# EAGLE design raspberrypi_debugger (EAGLE 7.3.0)
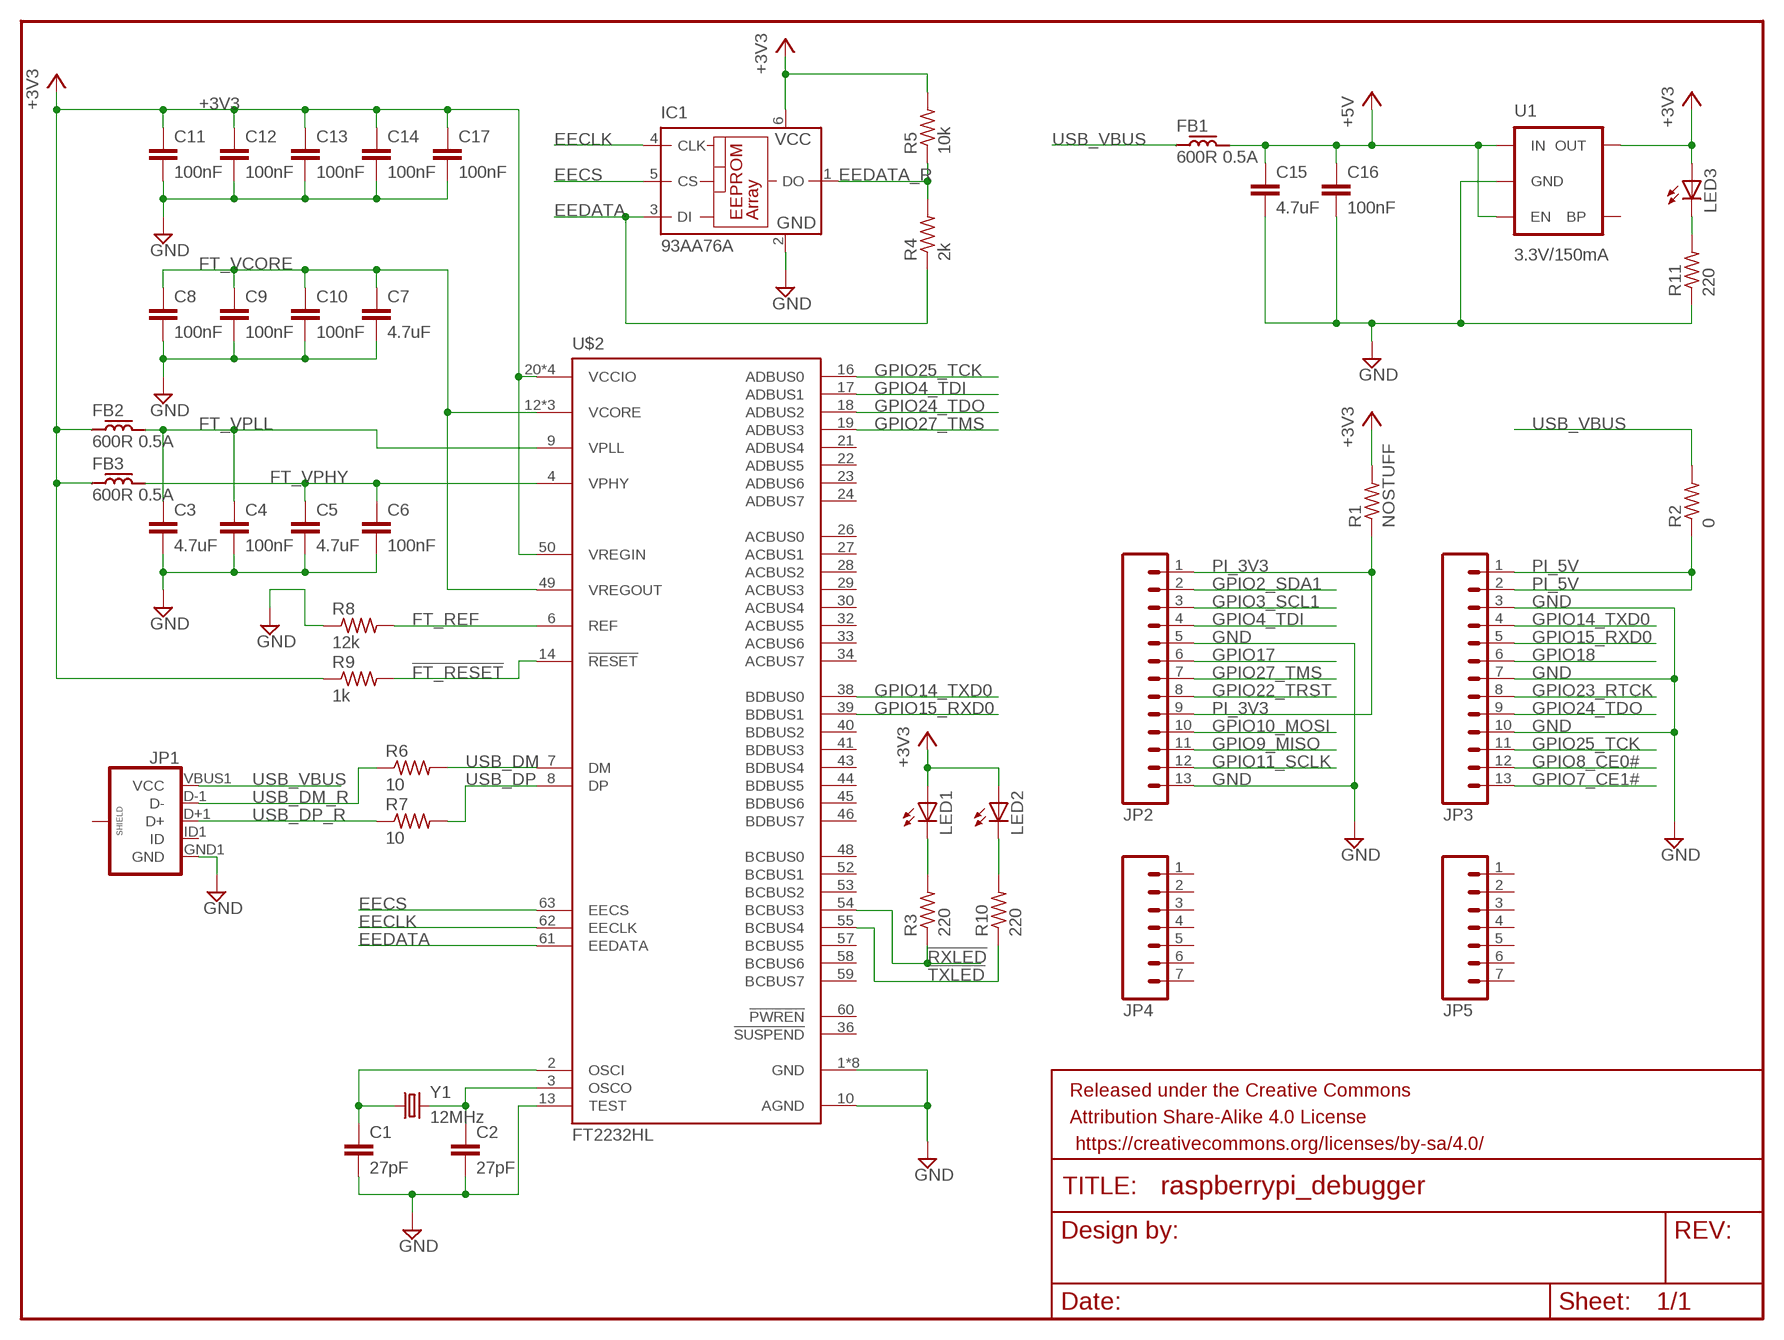
[diagram p0: schematic, sheet 1]

## Parts
C1  27pF  C-EUC0805  [C0805]
C2  27pF  C-EUC0805  [C0805]
C3  4.7uF  C-EUC1206  [C1206]
C4  100nF  C-EUC0805  [C0805]
C5  4.7uF  C-EUC1206  [C1206]
C6  100nF  C-EUC0805  [C0805]
C7  4.7uF  C-EUC1206  [C1206]
C8  100nF  C-EUC0805  [C0805]
C9  100nF  C-EUC0805  [C0805]
C10  100nF  C-EUC0805  [C0805]
C11  100nF  C-EUC0805  [C0805]
C12  100nF  C-EUC0805  [C0805]
C13  100nF  C-EUC0805  [C0805]
C14  100nF  C-EUC0805  [C0805]
C15  4.7uF  C-EUC1206  [C1206]
C16  100nF  C-EUC0805  [C0805]
C17  100nF  C-EUC0805  [C0805]
FB1  600R 0.5A  FERRITE  [R0805]
FB2  600R 0.5A  FERRITE  [R0805]
FB3  600R 0.5A  FERRITE  [R0805]
FRAME1  FRAME-LETTERNO_PACKAGE  [DUMMY]
IC1  93AA76A  [SOT23-6]
JP1  USB_MICROB_PLUGCONN-11752  [USB-B-MICRO-SMD_V03]
JP2  M13LOCK  [1X13_LOCK]
JP3  M13LOCK  [1X13_LOCK]
JP4  M07LOCK  [1X07_LOCK]
JP5  M07LOCK  [1X07_LOCK]
LED1  LEDCHIP-LED0805  [CHIP-LED0805]
LED2  LEDCHIP-LED0805  [CHIP-LED0805]
LED3  LEDCHIP-LED0805  [CHIP-LED0805]
R1  NOSTUFF  R-US_R0805  [R0805]
R2  0  R-US_R0805  [R0805]
R3  220  R-US_R0805  [R0805]
R4  2k  R-US_R0805  [R0805]
R5  10k  R-US_R0805  [R0805]
R6  10  R-US_R0805  [R0805]
R7  10  R-US_R0805  [R0805]
R8  12k  R-US_R0805  [R0805]
R9  1k  R-US_R0805  [R0805]
R10  220  R-US_R0805  [R0805]
R11  220  R-US_R0805  [R0805]
U1  3.3V/150mA  V_REG_MIC52053.3V  [SOT23-5]
U$2  FT2232HL  [TQFP64-10X10]
Y1  12MHz  CRYSTALSMD  [HC49UP]

## Nets
!FT_RESET: R9.2 U$2.14(!RESET)
!RXLED: R3.1 U$2.54(BCBUS3)
!TXLED: R10.1 U$2.55(BCBUS4)
+3V3: C11.1 C12.1 C13.1 C14.1 C17.1 FB2.2 FB3.2 IC1.6(VCC) LED1.A LED2.A LED3.A R1.2 R5.2 R9.1 U1.5(OUT) U$2.20(VCCIO) U$2.31(VCCIO) U$2.42(VCCIO) U$2.50(VREGIN) U$2.56(VCCIO)
+5V: C15.1 C16.1 FB1.1 U1.1(IN) U1.3(EN)
EECLK: IC1.4(CLK) U$2.62(EECLK)
EECS: IC1.5(CS) U$2.63(EECS)
EEDATA: IC1.3(DI) R4.1 U$2.61(EEDATA)
EEDATA_R: IC1.1(DO) R4.2 R5.1
FT_REF: R8.2 U$2.6(REF)
FT_VCORE: C7.1 C8.1 C9.1 C10.1 U$2.12(VCORE) U$2.37(VCORE) U$2.49(VREGOUT) U$2.64(VCORE)
FT_VPHY: C5.1 C6.1 FB3.1 U$2.4(VPHY)
FT_VPLL: C3.1 C4.1 FB2.1 U$2.9(VPLL)
GND: C1.2 C2.2 C3.2 C4.2 C5.2 C6.2 C7.2 C8.2 C9.2 C10.2 C11.2 C12.2 C13.2 C14.2 C15.2 C16.2 C17.2 IC1.2(GND) JP1.GND1(GND) JP2.5 JP2.13 JP3.3 JP3.7 JP3.10 R8.1 R11.1 U1.2(GND) U$2.1(GND) U$2.5(GND) U$2.10(AGND) U$2.11(GND) U$2.13(TEST) U$2.15(GND) U$2.25(GND) U$2.35(GND) U$2.47(GND) U$2.51(GND)
GPIO2_SDA1: JP2.2
GPIO3_SCL1: JP2.3
GPIO4_TDI: JP2.4 U$2.17(ADBUS1)
GPIO7_CE1#: JP3.13
GPIO8_CE0#: JP3.12
GPIO9_MISO: JP2.11
GPIO10_MOSI: JP2.10
GPIO11_SCLK: JP2.12
GPIO14_TXD0: JP3.4 U$2.38(BDBUS0)
GPIO15_RXD0: JP3.5 U$2.39(BDBUS1)
GPIO17: JP2.6
GPIO18: JP3.6
GPIO22_TRST: JP2.8
GPIO23_RTCK: JP3.8
GPIO24_TDO: JP3.9 U$2.18(ADBUS2)
GPIO25_TCK: JP3.11 U$2.16(ADBUS0)
GPIO27_TMS: JP2.7 U$2.19(ADBUS3)
N$1: C1.1 U$2.2(OSCI) Y1.1
N$2: C2.1 U$2.3(OSCO) Y1.2
N$3: LED1.C R3.2
N$4: LED2.C R10.2
N$5: LED3.C R11.2
PI_3V3: JP2.1 JP2.9 R1.1
PI_5V: JP3.1 JP3.2 R2.1
USB_DM: R6.2 U$2.7(DM)
USB_DM_R: JP1.D-1(D-) R6.1
USB_DP: R7.2 U$2.8(DP)
USB_DP_R: JP1.D+1(D+) R7.1
USB_VBUS: FB1.2 JP1.VBUS1(VCC) R2.2
Unconnected: JP1.ID1(ID) JP1.SHIELD1(SHIELD) JP1.SHIELD2(SHIELD) JP1.SHIELD3(SHIELD) JP4.1 JP4.2 JP4.3 JP4.4 JP4.5 JP4.6 JP4.7 JP5.1 JP5.2 JP5.3 JP5.4 JP5.5 JP5.6 JP5.7 U1.4(BP) U$2.21(ADBUS4) U$2.22(ADBUS5) U$2.23(ADBUS6) U$2.24(ADBUS7) U$2.26(ACBUS0) U$2.27(ACBUS1) U$2.28(ACBUS2) U$2.29(ACBUS3) U$2.30(ACBUS4) U$2.32(ACBUS5) U$2.33(ACBUS6) U$2.34(ACBUS7) U$2.36(!SUSPEND) U$2.40(BDBUS2) U$2.41(BDBUS3) U$2.43(BDBUS4) U$2.44(BDBUS5) U$2.45(BDBUS6) U$2.46(BDBUS7) U$2.48(BCBUS0) U$2.52(BCBUS1) U$2.53(BCBUS2) U$2.57(BCBUS5) U$2.58(BCBUS6) U$2.59(BCBUS7) U$2.60(!PWREN)

## Library data of the parts
C1-C17 = resistor:C-EU: CAPACITOR, European symbol
FB1-FB3 = raspberrypi_debugger_special:FERRITE: INDUCTOR, American symbol
FRAME1 = SparkFun-Aesthetics:FRAME-LETTER: Schematic Frame Standard 8.5x11 US Letter frame; DESIGNER: Nobody; VERSION: v01
IC1 = microchip:93*76?: 8K Microwire Compatible Serial EEPROM Source: http://ww1.microchip.com/downloads/en/DeviceDoc/21796H.pdf; MPN: 93AA76AT-I/OT; OC_FARNELL: 1331443; OC_NEWARK: 35M2481
JP1 = raspberrypi_debugger_special:USB_MICROB_PLUG: USB Micro-B connectors Some male, some female. Watch your step!; PROD_ID: CONN-11752
JP2 JP3 = SparkFun-Connectors:M13: 13-pin single row .1" header
JP4 JP5 = SparkFun-Connectors:M07: Header 7 Standard 7-pin 0.1" header. Use with straight break away headers (SKU : PRT-00116), right angle break away headers (PRT-00553), swiss pins (PRT-00743), machine pins (PRT-00117), and female headers (PRT-00115). NOTES ON THE VARIANTS LOCK and LOCK_LONGPADS... This footprint was designed to help hold the alignment of a through-hole component (i.e. 7-pin header) while soldering it into place. You may notice that each hole has been shifted either up or down by 0.005 of an inch from it's more standard position (which is usually a perfectly straight line). This slight alteration caused the pins (the squares in the middle) to touch the edges of the holes. Because they are alternating, it causes a "brace" to hold the header in place. 0.005 has proven to be the perfect amount of "off-center" position when using our standard breakaway headers. Although looks a little odd when you look at the bare footprint, once you have a header in there, the alteration is very hard to notice. Also, if you push a header all the way into place, it is covered up entirely on the bottom side. This idea of altering the position of holes to aid alignment will be further integrated into the Sparkfun Library for other footprints. It can help hold any component with 3 or more connection pins.
LED1-LED3 = led:LED: LED OSRAM: - CHIPLED LG R971, LG N971, LY N971, LG Q971, LY Q971, LO R971, LY R971 LH N974, LH R974 LS Q976, LO Q976, LY Q976 LO Q996 - Hyper CHIPLED LW Q18S LB Q993, LB Q99A, LB R99A - SideLED LS A670, LO A670, LY A670, LG A670, LP A670 LB A673, LV A673, LT A673, LW A673 LH A674 LY A675 LS A676, LA A676, LO A676, LY A676, LW A676 LS A679, LY A679, LG A679 - Hyper Micro SIDELED® LS Y876, LA Y876, LO Y876, LY Y876 LT Y87S - SmartLED LW L88C, LW L88S LB L89C, LB L89S, LG L890 LS L89K, LO L89K, LY L89K LS L896, LA L896, LO L896, LY L896 - TOPLED LS T670, LO T670, LY T670, LG T670, LP T670 LSG T670, LSP T670, LSY T670, LOP T670, LYG T670 LG T671, LOG T671, LSG T671 LB T673, LV T673, LT T673, LW T673 LH T674 LS T676, LA T676, LO T676, LY T676, LB T676, LH T676, LSB T676, LW T676 LB T67C, LV T67C, LT T67C, LS T67K, LO T67K, LY T67K, LW E67C LS E67B, LA E67B, LO E67B, LY E67B, LB E67C, LV E67C, LT E67C LW T67C LS T679, LY T679, LG T679 LS T770, LO T770, LY T770, LG T770, LP T770 LB T773, LV T773, LT T773, LW T773 LH T774 LS E675, LA E675, LY E675, LS T675 LS T776, LA T776, LO T776, LY T776, LB T776 LHGB T686 LT T68C, LB T68C - Hyper Mini TOPLED® LB M676 - Mini TOPLED Santana® LG M470 LS M47K, LO M47K, LY M47K Source: http://www.osram.convergy.de LUXEON: - LUMILED® LXK2-PW12-R00, LXK2-PW12-S00, LXK2-PW14-U00, LXK2-PW14-V00 LXK2-PM12-R00, LXK2-PM12-S00, LXK2-PM14-U00 LXK2-PE12-Q00, LXK2-PE12-R00, LXK2-PE12-S00, LXK2-PE14-T00, LXK2-PE14-U00 LXK2-PB12-K00, LXK2-PB12-L00, LXK2-PB12-M00, LXK2-PB14-N00, LXK2-PB14-P00, LXK2-PB14-Q00 LXK2-PR12-L00, LXK2-PR12-M00, LXK2-PR14-Q00, LXK2-PR14-R00 LXK2-PD12-Q00, LXK2-PD12-R00, LXK2-PD12-S00 LXK2-PH12-R00, LXK2-PH12-S00 LXK2-PL12-P00, LXK2-PL12-Q00, LXK2-PL12-R00 Source: www.luxeon.com KINGBRIGHT: KA-3528ASYC Source: www.kingbright.com
R1-R11 = resistor:R-US_: RESISTOR, American symbol
U1 = SparkFun-PowerIC:V_REG_MIC5205: V_REG MIC5205 Standard 3.3V, 5V, and Adjustable 150mA LDO voltage regulator in SOT-23 layout. Micrel part MIC5205. BP (by-pass) pin is used to lower output noise with 470pF cap, may be left open. On the adjustable version BP is used to set output.; PROD_ID: VREG-00822
U$2 = raspberrypi_debugger_special:FT2232HL
Y1 = SparkFun-FreqCtrl:CRYSTAL: Various standard crystals. Proven footprints.

## Board
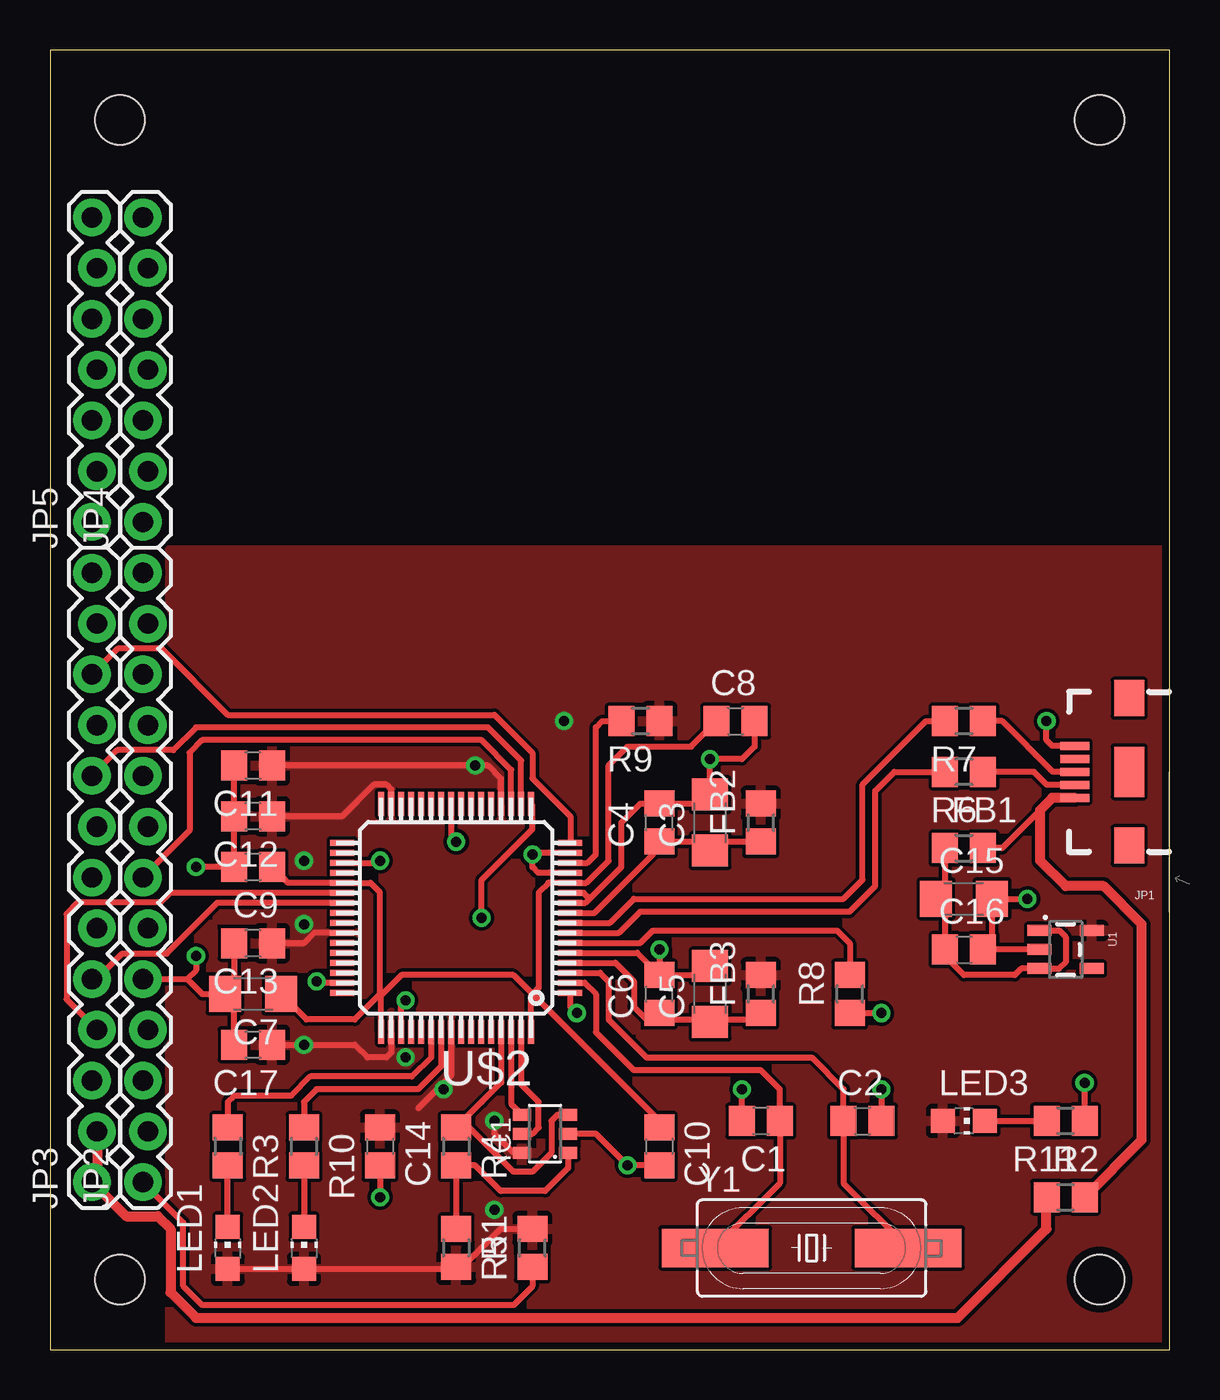
[diagram p1: board, top side]
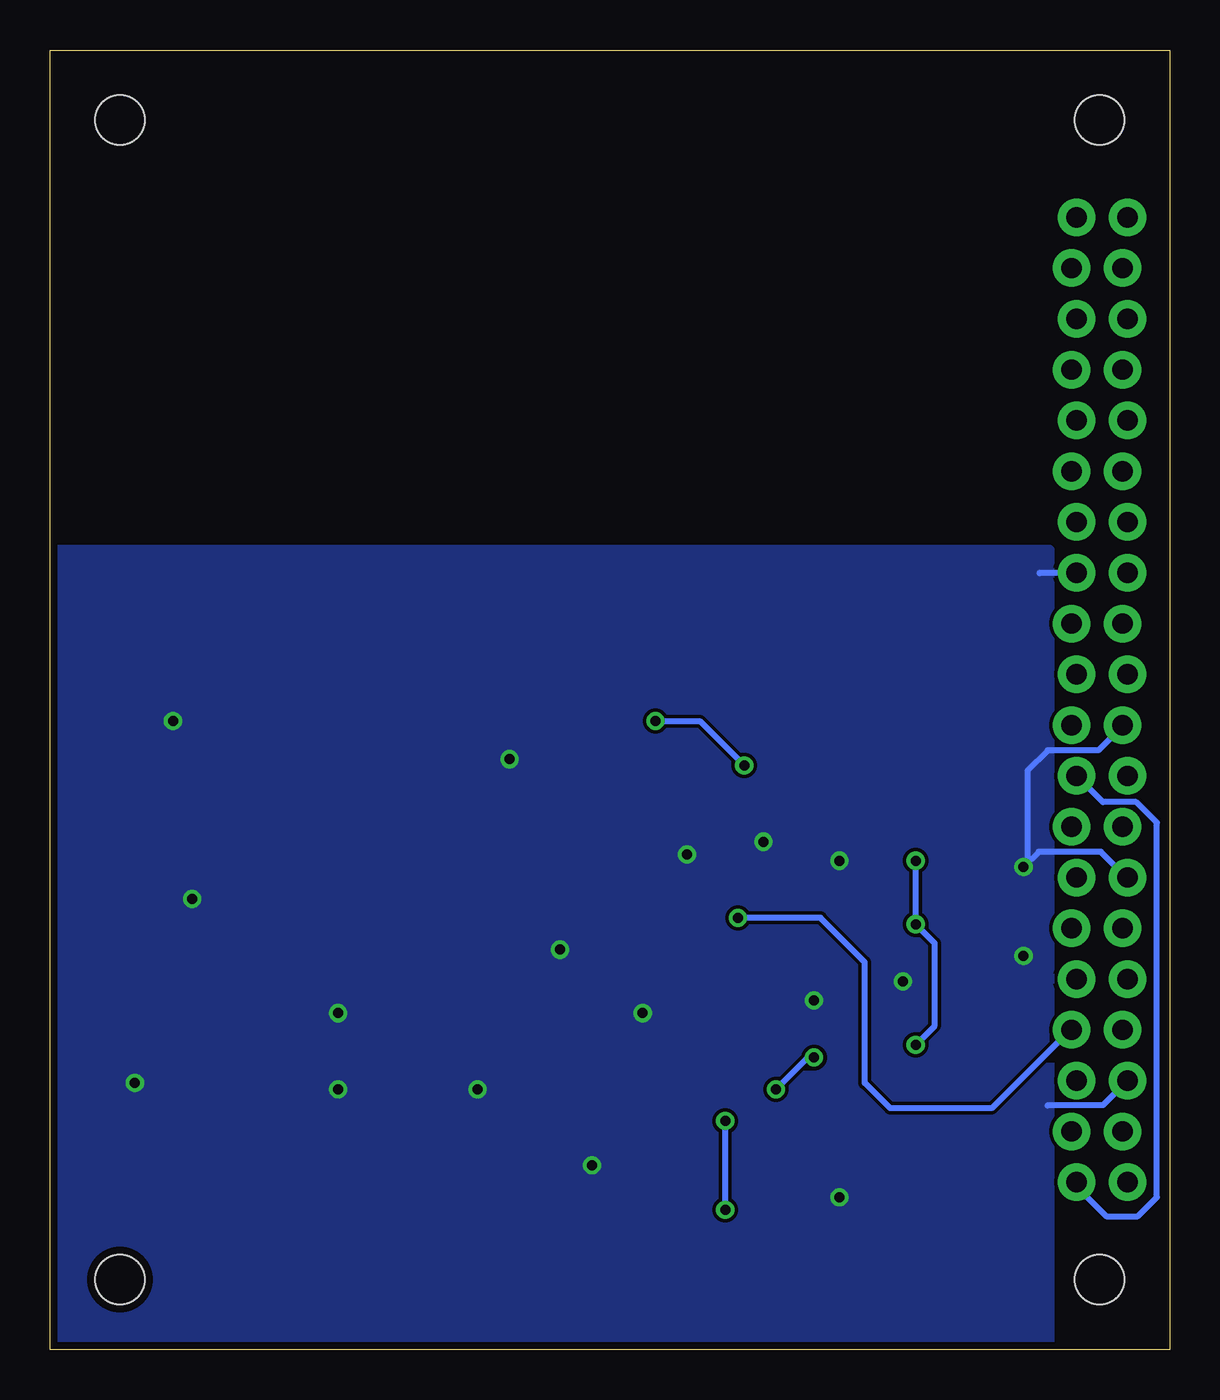
[diagram p2: board, bottom side, seen from below]

Size 56 x 65 mm. Coordinates in mm from the lower left corner, seen from the top.
Outline: 0,0 56,0 56,65 0,65 0,0
Copper layers (1*16): Top 0.035mm / dielectric 1.5mm / Bottom 0.035mm
Design rules "default *": minimum track width 5mil, minimum drill 12mil, track to track 7mil, track to pad 7mil, pad to pad 7mil, via to via 7mil, smd to smd 7mil, copper to edge 15mil, drill to drill 20mil, minimum pad ring 10mil, minimum via ring 8mil, stop-mask expansion 4mil, vias tented up to drill 0mil, thermal gap 10mil
Holes 2.49 mm at 3.5,3.5 3.5,61.5 52.5,61.5 52.5,3.5

### Footprints (pad centres in the part's own frame; a part is rotated, then mirrored left to right if it is on the bottom)
C0805 = smd 1.3 x 1.5: 1 -0.95,0; 2 0.95,0
C1206 = smd 1.6 x 1.8: 1 -1.4,0; 2 1.4,0
R0805 = smd 1.3 x 1.5: 1 -0.95,0; 2 0.95,0
SOT23-6 = smd 0.6 x 0.9: 1 -0.95,-1.15; 2 0,-1.15; 3 0.95,-1.15; 4 0.95,1.15; 5 0,1.15; 6 -0.95,1.15
USB-B-MICRO-SMD_V03 = smd 1.45 x 0.4: D+1 2.725,0; D-1 2.725,0.65; GND1 2.725,-1.3; ID1 2.725,-0.65; VBUS1 2.725,1.3 | smd 1.5 x 1.8: SHIELD1 0,3.685; SHIELD2 0,-3.685 | smd 1.5 x 2.5: SHIELD3 0,0
1X13_LOCK = drill 1.016 pad 1.88: 1 0,0.127; 2 2.54,-0.127; 3 5.08,0.127; 4 7.62,-0.127; 5 10.16,0.127; 6 12.7,-0.127; 7 15.24,0.127; 8 17.78,-0.127; 9 20.32,0.127; 10 22.86,-0.127; 11 25.4,0.127; 12 27.94,-0.127; 13 30.48,0.127
1X07_LOCK = drill 1.016 pad 1.88: 1 0,0.127; 2 2.54,-0.127; 3 5.08,0.127; 4 7.62,-0.127; 5 10.16,0.127; 6 12.7,-0.127; 7 15.24,0.127
CHIP-LED0805 = smd 1.2 x 1.2: A 0,-1.05; C 0,1.05
SOT23-5 = smd 0.55 x 1.2: 1 -0.95,-1.3; 2 0,-1.3; 3 0.95,-1.3; 4 0.95,1.3; 5 -0.95,1.3
TQFP64-10X10 = smd 1.2 x 0.3: 1 -5.7,3.75; 2 -5.7,3.25; 3 -5.7,2.75; 4 -5.7,2.25; 5 -5.7,1.75; 6 -5.7,1.25; 7 -5.7,0.75; 8 -5.7,0.25; 9 -5.7,-0.25; 10 -5.7,-0.75; 11 -5.7,-1.25; 12 -5.7,-1.75; 13 -5.7,-2.25; 14 -5.7,-2.75; 15 -5.7,-3.25; 16 -5.7,-3.75; 33 5.7,-3.75; 34 5.7,-3.25; 35 5.7,-2.75; 36 5.7,-2.25; 37 5.7,-1.75; 38 5.7,-1.25; 39 5.7,-0.75; 40 5.7,-0.25; 41 5.7,0.25; 42 5.7,0.75; 43 5.7,1.25; 44 5.7,1.75; 45 5.7,2.25; 46 5.7,2.75; 47 5.7,3.25; 48 5.7,3.75 | smd 0.3 x 1.2: 17 -3.75,-5.7; 18 -3.25,-5.7; 19 -2.75,-5.7; 20 -2.25,-5.7; 21 -1.75,-5.7; 22 -1.25,-5.7; 23 -0.75,-5.7; 24 -0.25,-5.7; 25 0.25,-5.7; 26 0.75,-5.7; 27 1.25,-5.7; 28 1.75,-5.7; 29 2.25,-5.7; 30 2.75,-5.7; 31 3.25,-5.7; 32 3.75,-5.7; 49 3.75,5.7; 50 3.25,5.7; 51 2.75,5.7; 52 2.25,5.7; 53 1.75,5.7; 54 1.25,5.7; 55 0.75,5.7; 56 0.25,5.7; 57 -0.25,5.7; 58 -0.75,5.7; 59 -1.25,5.7; 60 -1.75,5.7; 61 -2.25,5.7; 62 -2.75,5.7; 63 -3.25,5.7; 64 -3.75,5.7
HC49UP = smd 5.334 x 1.93: 1 -4.826,0; 2 4.826,0

### Placement (x,y rotation side)
C1  35.56,11.43 180 top
C2  40.64,11.43 0 top
C3  33.02,26.35 90 top
C4  30.48,26.35 90 top
C5  33.02,17.78 90 top
C6  30.48,17.78 90 top
C7  10.16,17.78 180 top
C8  34.29,31.43 0 top
C9  10.16,24.13 180 top
C10  30.48,10.16 270 top
C11  10.16,29.21 180 top
C12  10.16,26.67 180 top
C13  10.16,20.32 180 top
C14  16.51,10.16 270 top
C15  45.72,22.54 0 top
C16  45.72,20 0 top
C17  10.16,15.24 180 top
FB1  45.72,25.08 0 top
FB2  35.56,26.35 90 top
FB3  35.56,17.78 90 top
FRAME1  -58.42,60.96 0 top  (outside the outline)
IC1  24.77,10.79 90 top
JP1  53.98,28.89 180 top
JP2  4.77,8.37 90 top
JP3  2.23,8.37 90 top
JP4  4.77,41.39 90 top
JP5  2.23,41.39 90 top
LED1  8.89,5.08 0 top
LED2  12.7,5.08 0 top
LED3  45.72,11.43 270 top
R1  24.13,5.08 90 top
R2  50.8,7.62 0 top
R3  8.89,10.16 270 top
R4  20.32,10.16 270 top
R5  20.32,5.08 270 top
R6  45.72,28.89 180 top
R7  45.72,31.43 180 top
R8  40.01,17.78 90 top
R9  29.53,31.43 180 top
R10  12.7,10.16 270 top
R11  50.8,11.43 180 top
U1  50.8,20 270 top
U$2  20.32,21.59 180 top
Y1  38.1,5.08 0 top

### Tracks (layer width: path | path; a pad name or v marks a point on that pad's centre or on a via)
!FT_RESET
  Top 0.305: U$2.14 26.88,24.34 27.3,24.77 27.3,31.11 27.62,31.43 R9.2
!RXLED
  Top 0.305: R3.1 8.89,12.38 9.21,12.7 12.06,12.7 13.02,13.65 18.1,13.65 19.07,14.62 U$2.54
!TXLED
  Top 0.305: R10.1 12.7,12.38 13.34,13.02 18.41,13.02 19.57,14.17 U$2.55
+3V3  (via drill 0.5)
  Top 0.305: LED1.A LED2.A 20.22,4.03 R5.2 20.64,4.13 22.54,6.03 R1.2 | U$2.50 17.07,14.85 16.83,14.61 15.88,14.61 15.24,15.24 v12.7,15.24 C17.1 | U$2.42 13.22,20.84 12.7,20.32 C13.1 | U$2.31 17.07,28.02 16.83,28.26 16.19,28.26 14.61,26.67 C12.1 | U$2.20 22.57,28.55 21.91,29.21 C11.1 | IC1.6 23.18,9.85 22.23,10.79 v22.23,11.43 | U$2.56 20.07,13.72 18.41,12.06
  Bottom 0.305: v25.72,31.43 23.5,31.43 v21.27,29.21 | v12.7,24.45 v12.7,21.27 11.75,20.32 11.75,16.19 v12.7,15.24 | v22.23,6.99 v22.23,11.43 | v17.78,14.61 18.1,14.61 v19.68,13.02
  pour Top: 6,0 6,40 56,40 56,0
+5V
  Top 0.305: FB1.1 44.77,22.54 | 44.77,22.54 C16.1 45.09,19.69 45.09,19.37 45.72,18.73 48.26,18.73 48.58,19.05 U1.3 50.48,19.05 50.8,19.37 50.8,20.64 50.48,20.95 U1.1 | C15.1 44.77,22.54
EECLK
  Top 0.305: U$2.62 23.07,12.29 IC1.4
EECS
  Top 0.305: IC1.5 24.13,10.79 24.45,11.11 24.45,12.38 23.57,13.26 U$2.63
EEDATA
  Top 0.305: IC1.3 25.4,11.74 25.08,11.43 25.08,9.84 24.13,8.89 23.18,8.89 20.95,11.11 R4.1 21.59,12.38 22.57,13.36 U$2.61
EEDATA_R
  Top 0.305: IC1.1 25.91,9.09 24.77,7.94 22.54,7.94 21.27,9.21 R4.2 R5.1
FT_REF
  Top 0.305: U$2.6 29.55,20.34 30.16,20.95 39.37,20.95 40.01,20.32 R8.2
FT_VCORE
  Top 0.305: C10.1 30.48,11.43 24.13,17.78 | U$2.64 24.07,17.72 24.13,17.78 | U$2.49 16.57,17.72 | 16.57,17.72 16.51,17.78 | 16.51,17.78 16.51,22.86 16.03,23.34 U$2.37 11.9,23.34 C9.1 | 16.51,17.78 15.24,16.51 12.83,16.51 C7.1 | C8.1 32.07,30.16 28.89,30.16 27.94,29.21 27.94,24.45 26.83,23.34 U$2.12 24.93,23.34 24.45,22.86 24.45,18.1 24.13,17.78 | 24.13,17.78 23.18,18.73 17.58,18.73 16.57,17.72
FT_VPHY
  Top 0.305: U$2.4 28.29,19.34 29.21,18.41 29.21,17.14 29.84,16.51 30.16,16.51 | 30.16,16.51 33.02,16.51 | 33.02,16.51 35.24,16.51 FB3.1 | 30.16,16.51 C6.1 | C5.1 33.02,16.51
FT_VPLL
  Top 0.305: 33.34,25.4 C4.1 30.16,25.09 30.16,24.77 27.24,21.84 U$2.9 | 33.34,25.4 FB2.1 | C3.1 33.02,25.09 33.34,25.4
GND  (via drill 0.5)
  Top 0.305: U1.2 C16.2 47.12,20.45 C15.2 v48.9,22.54 | v41.59,13.02 C2.2 | C1.2 v34.61,13.02 | C10.2 v28.89,9.21 27.3,10.79 IC1.2 | R8.1 v41.59,16.83 | JP1.GND1 50.13,30.19 49.85,30.48 v49.85,31.43 | JP2.5 6.87,18.53 | 6.87,18.53 7.62,17.78 C7.2 | C13.2 9.21,18.23 C7.2 | C17.2 9.21,17.33 C7.2 | U$2.35 16.4,24.34 v16.51,24.45 | U$2.25 20.07,25.65 v20.32,25.4 | U$2.47 13.41,18.34 v13.34,18.41 | U$2.51 17.57,17.25 v17.78,17.46 | C8.2 35.24,30.16 34.61,29.53 v33.02,29.53 C3.2 32.57,27.3 C4.2 29.53,27.3 28.57,26.35 28.57,24.13 26.99,22.54 | U$2.1 26.02,17.16 v26.35,16.83 | U$2.5 29.37,19.84 C6.2 | C6.2 32.57,18.73 C5.2 | U$2.13 24.42,23.84 24.13,24.13 v24.13,24.77 24.2,24.84 U$2.15 | U$2.10 26.79,22.34 26.99,22.54 | U$2.11 26.69,22.84 26.99,22.54 | v7.3,24.13 C9.2 C12.2 C11.2 | C14.2 v16.51,7.62 | R11.1 v51.75,13.33 v51.75,13.34 | v30.48,20 C6.2 | v7.3,19.68 7.3,18.96 6.87,18.53
  Bottom 0.305: JP3.7 2.15,23.61 3.43,24.89 6.54,24.89 v7.3,24.13 7.11,24.32 7.11,28.96 6.1,29.97 3.56,29.97 2.36,31.17 JP3.10 | JP3.3 3.33,12.22 6.07,12.22 6.1,12.19 | JP2.13 6.49,38.85 6.5,38.84
  pour Bottom: 6,0 6,40 56,40 56,0
GPIO4_TDI  (via drill 0.5)
  Top 0.305: v21.59,21.59 21.59,23.5 24.13,26.04 24.13,27.23 U$2.17
  Bottom 0.305: JP2.4 4.96,15.99 8.89,12.06 13.97,12.06 15.24,13.34 15.24,19.37 17.46,21.59 v21.59,21.59
GPIO14_TXD0
  Top 0.305: U$2.38 6.01,22.84 5.52,22.35 1.4,22.35 0.83,21.78 0.83,17.52 JP3.4
GPIO15_RXD0
  Top 0.305: JP3.5 2.34,18.53 3.62,19.81 5.84,19.81 8.37,22.34 U$2.39
GPIO24_TDO
  Top 0.305: U$2.18 23.57,29.45 21.91,31.11 7.3,31.11 6.17,29.98 3.37,29.98 JP3.9
GPIO25_TCK
  Top 0.305: JP3.11 3.38,35.05 5.59,35.05 8.89,31.75 22.23,31.75 24.13,29.84 24.13,28.57 26.04,26.67 26.04,25.36 U$2.16
GPIO27_TMS
  Top 0.305: U$2.19 23.07,29 21.59,30.48 7.62,30.48 6.99,29.84 6.99,25.95 JP2.7
N$1
  Top 0.305: Y1.1 36.51,8.32 C1.1 36.51,13.02 35.56,13.97 29.21,13.97 27.3,15.88 27.3,17.78 26.75,18.34 U$2.2
N$2
  Top 0.305: Y1.2 39.69,8.32 C2.1 39.69,13.02 38.1,14.61 29.84,14.61 27.94,16.51 27.94,18.41 27.52,18.84 U$2.3
N$3
  Top 0.305: LED1.C R3.2
N$4
  Top 0.305: R10.2 LED2.C
N$5
  Top 0.305: LED3.C R11.2
PI_3V3
  Top 0.305: R1.1 24.13,3.17 23.18,2.22 7.62,2.22 6.67,3.17 6.67,6.35 JP2.1
  Bottom 0.305: JP2.1 4.64,8.14 3.17,6.67 1.59,6.67 0.64,7.62 0.64,26.35 1.66,27.38 3.33,27.38 JP2.9
PI_5V
  Top 0.508: JP3.2 2.36,8.62 | 2.36,8.62 JP3.1 | 2.36,8.62 2.36,8.12 3.81,6.67 5.4,6.67 6.03,6.03 6.03,2.86 7.3,1.59 45.4,1.59 49.85,6.03 R2.1
USB_DM
  Top 0.305: U$2.7 28.46,20.84 29.53,21.91 40.01,21.91 41.27,23.18 41.27,27.94 42.23,28.89 R6.2
USB_DM_R
  Top 0.305: JP1.D-1 49.86,28.24 49.21,28.89 R6.1
USB_DP
  Top 0.305: U$2.8 28.01,21.34 29.21,22.54 39.69,22.54 40.64,23.5 40.64,28.26 43.81,31.43 R7.2
USB_DP_R
  Top 0.305: JP1.D+1 50.16,28.89 47.62,31.43 R7.1
USB_VBUS
  Top 0.305: 49.53,26.99 47.62,25.08 FB1.2
  Top 0.508: JP1.VBUS1 50.13,27.59 49.53,26.99 49.53,24.45 50.8,23.18 52.7,23.18 54.61,21.27 54.61,10.48 R2.2